# Altium schematic sheet LCD.SchDoc
size 420 x 297 mm; SheetNumber: 6; SheetTotal: 6
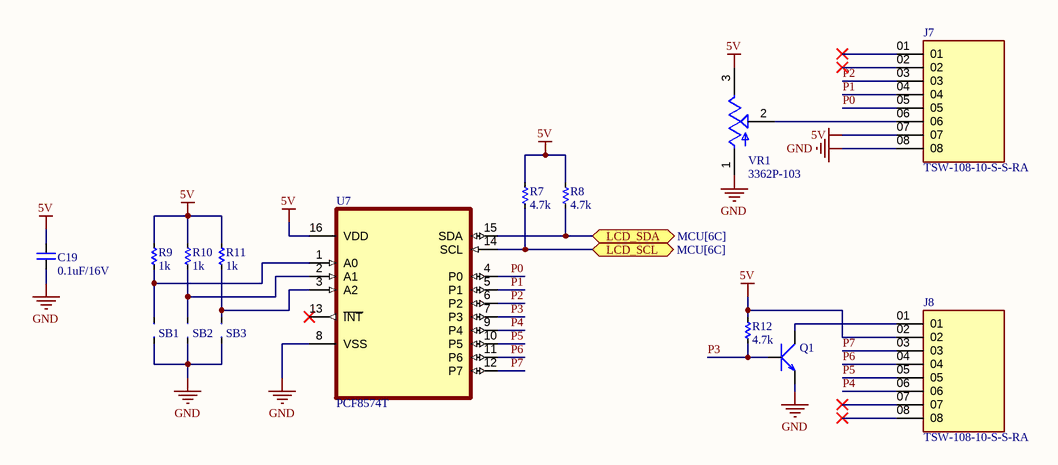
[diagram p0: LCD.SchDoc]

## Parts
C19  0.1uF/16V  [CAP_C_1608X80]
J7  TSW-108-10-S-S-RA  [SAMTEC_TSW-108-10-S-S-RA]
J8  TSW-108-10-S-S-RA  [SAMTEC_TSW-108-10-S-S-RA]
Q1  SMD-TRANSISTORS-NPN-25V-500MW(SOT-23)  [SOT-23]  (value not drawn)
R7  4.7k  [RES_C_1608X60]
R8  4.7k  [RES_C_1608X60]
R9  1k  [RES_C_1608X60]
R10  1k  [RES_C_1608X60]
R11  1k  [RES_C_1608X60]
R12  4.7k  [RES_C_1608X60]
SB1  JUMPER  [JUMPER_1608]  (value not drawn)
SB2  JUMPER  [JUMPER_1608]  (value not drawn)
SB3  JUMPER  [JUMPER_1608]  (value not drawn)
U7  PCF8574T  [SOIC127P1032X265-16N]
VR1  3362P-103  [TRIM_3362P-103]

## Ports
LCD_SCL (bidir, see MCU[6C]), LCD_SDA (bidir, see MCU[6C])

## Nets
5V: C19.2 J7.07 J8.02 R7.2 R8.2 R9.2 R10.2 R11.2 R12.2 U7.16(VDD) VR1.3(CW)
GND: C19.1 J7.08 Q1.2(E) SB1.1 SB2.1 SB3.1 U7.8(VSS) VR1.1(CCW)
LCD_SCL: R7.1 U7.14(SCL) ; port LCD_SCL
LCD_SDA: R8.1 U7.15(SDA) ; port LCD_SDA
P0: J7.05 U7.4(P0)
P1: J7.04 U7.5(P1)
P2: J7.03 U7.6(P2)
P3: Q1.1(B) R12.1 U7.7(P3)
P4: J8.06 U7.9(P4)
P5: J8.05 U7.10(P5)
P6: J8.04 U7.11(P6)
P7: J8.03 U7.12(P7)
NetJ7_06: J7.06 VR1.2(WIPER)
NetJ8_01: J8.01 Q1.3(C)
NetR9_1: R9.1 SB1.2 U7.1(A0)
NetR10_1: R10.1 SB2.2 U7.2(A1)
NetR11_1: R11.1 SB3.2 U7.3(A2)

Not connected (* = marked no-connect by the designer): J7 01* 02*; J8 07* 08*; U7 13(~{INT})*

## Notes on the sheet
- Sub-system:
- Project:
- Design by:
- Sheet title:
- Sheet
- of
- Checked by:
- Approved by:
- Doc No:
- Revision:
- Size:
- Date:
- A3

## Library data of the parts
C19 = CAP_SMD: CAP_Chip; Value: 33pF
J7 J8 = TSW-108-10-S-S-RA: Connector Header Through Hole, Right Angle 8 position 0.100 (2.54mm); MF: Samtec; SnapEDA_Link: https://www.snapeda.com/parts/TSW-108-10-S-S-RA/Samtec/view-part/?ref=snap; Package: None; Value: *; MP: TSW-108-10-S-S-RA; Check_prices: https://www.snapeda.com/parts/TSW-108-10-S-S-RA/Samtec/view-part/?ref=eda
Q1 = SMD-TRANSISTORS-NPN-25V-500MW(SOT-23): Bipolar (BJT) Transistor NPN 25 V 500 mA 150MHz 300 mW Surface Mount SOT-23; MF: UMW; MP: S8050; Purchase-URL: https://pricing.snapeda.com/search/part/S8050/?ref=eda; Check_prices: https://www.snapeda.com/parts/S8050/Umwelt+Sensor+Teknik/view-part/?ref=eda; SnapEDA_Link: https://www.snapeda.com/parts/S8050/Umwelt+Sensor+Teknik/view-part/?ref=snap; Price: None; Availability: In Stock; Package: None; Value: *
R7-R12 = RES_SMD: RES
U7 = PCF8574T: I/O Expander 8 IÂ²C 100 kHz 20-SSOP; MF: NXP Semiconductors; MP: PCF8574T; Price: None; Availability: In Stock; Package: SOIC-16 NXP Semiconductors; Purchase-URL: https://pricing.snapeda.com/search/part/PCF8574T/?ref=eda; SnapEDA_Link: https://www.snapeda.com/parts/PCF8574T/NXP+Semiconductors/view-part/?ref=snap; Value: *; Check_prices: https://www.snapeda.com/parts/PCF8574T/NXP+Semiconductors/view-part/?ref=eda
VR1 = 3362P-103: 10 kOhms 0.5W, 1/2W PC Pins Through Hole Trimmer Potentiometer Cermet 1 Turn Top Finger Adjustment; MF: Bourns; SnapEDA_Link: https://www.snapeda.com/parts/3362P-103/Bourns/view-part/?ref=snap; Package: 3362P-1 Bourns Inc.; Value: *; MP: 3362P-103; Check_prices: https://www.snapeda.com/parts/3362P-103/Bourns/view-part/?ref=eda